# Altium project SuperKnobLite.PrjPcb
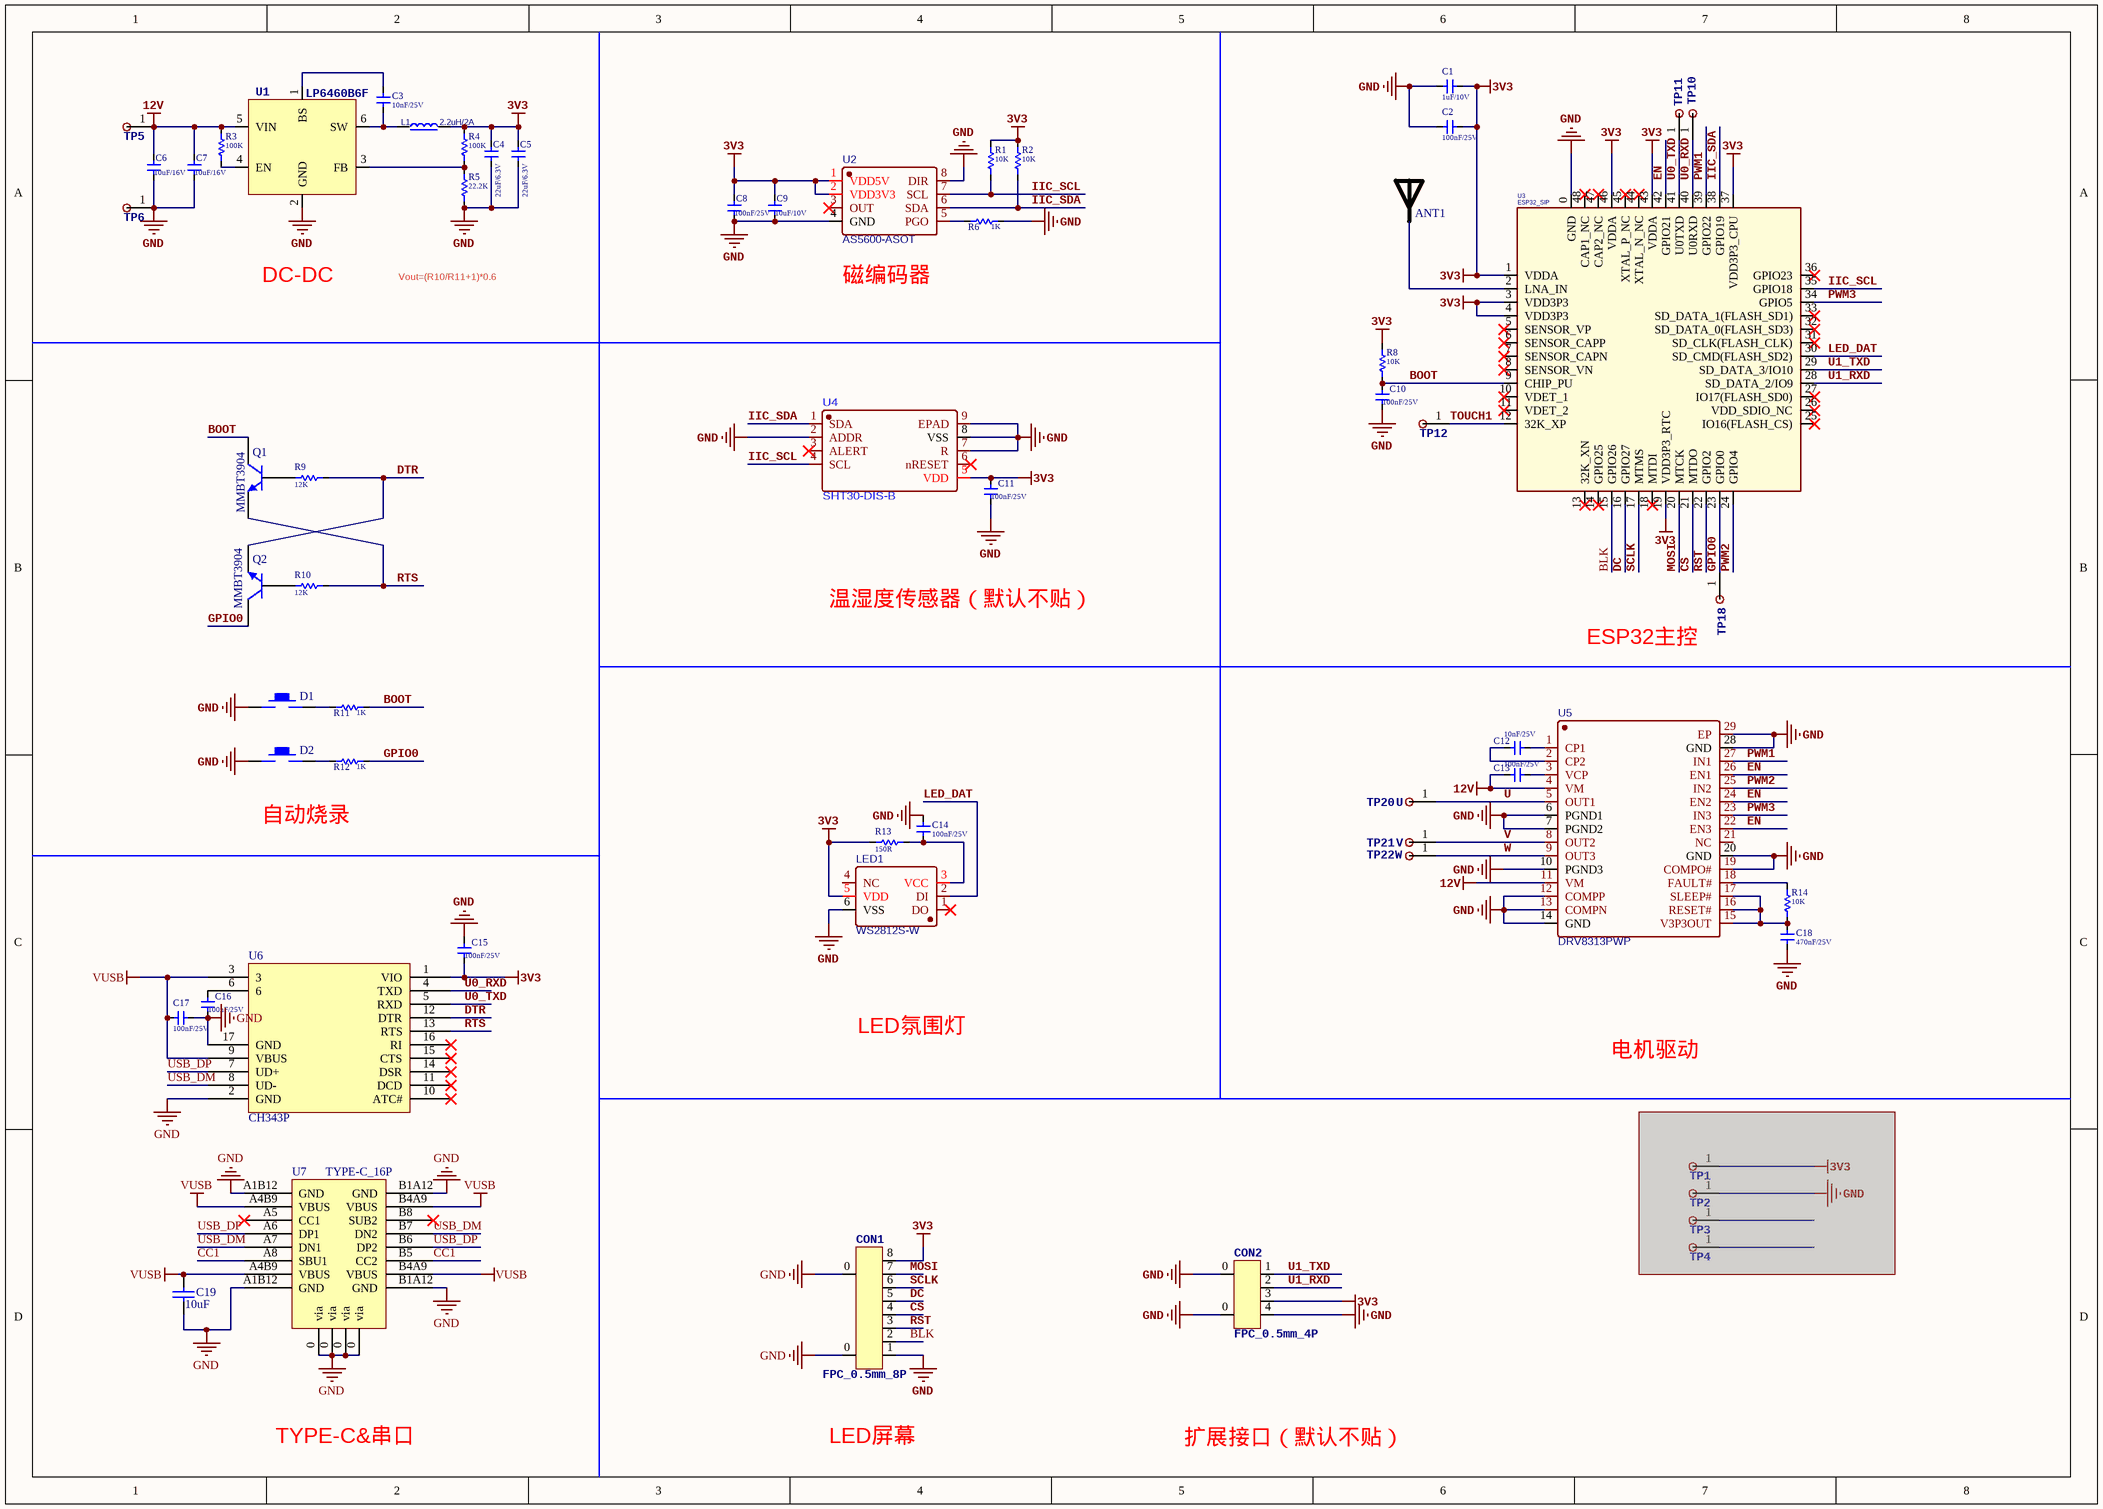
[diagram p0: SuperKnobLite.SchDoc]
1 sheet, 61 parts. Net scope: global (net labels, ports and power ports of the same name join across sheets).
Board file: SuperKnobLite.PcbDoc

## Sheet SuperKnobLite.SchDoc
size A3

### Parts
ANT1  RAINSUN  [ANT-Rainsun-AN5120]  (value not drawn)
C1  1uF/10V  [CAPC_0402]
C2  100nF/25V  [CAPC_0402]
C3  10nF/25V  [CAPC_0402]
C4  22uF/6.3V  [CAPC_0805]
C5  22uF/6.3V  [CAPC_0805]
C6  10uF/16V  [CAPC_0805]
C7  10uF/16V  [CAPC_0805]
C8  100nF/25V  [CAPC_0402]
C9  10uF/10V  [CAPC_0402]
C10  100nF/25V  [CAPC_0402]
C11  100nF/25V  [CAPC_0402]
C12  10nF/25V  [CAPC_0402]
C13  100nF/25V  [CAPC_0402]
C14  100nF/25V  [CAPC_0402]
C15  100nF/25V  [CAPC_0402]
C16  100nF/25V  [CAPC_0402]
C17  100nF/25V  [CAPC_0402]
C18  470nF/25V  [CAPC_0402]
C19  10uF  [CAPC_0603]
CON1  FPC_0.5mm_8P  [FFC_0.5_8]
CON2  FPC_0.5mm_4P  [FPC_0.5_4P]
D1  KEY_M  [KEY]  (value not drawn)
D2  KEY_M  [KEY]  (value not drawn)
L1  2.2uH/2A  [Inductor_CD_43]
LED1  WS2812S-W  [LED-SMD_6P-L5.0-W5.0-TL]
Q1  MMBT3904  [SOT23_3]
Q2  MMBT3904  [SOT23_3]
R1  10K  [RESC_0402]
R2  10K  [RESC_0402]
R3  100K  [RESC_0402]
R4  100K  [RESC_0402]
R5  22.2K  [RESC_0402]
R6  1K  [RESC_0402]
R8  10K  [RESC_0402]
R9  12K  [RESC_0402]
R10  12K  [RESC_0402]
R11  1K  [RESC_0402]
R12  1K  [RESC_0402]
R13  150R  [RESC_0603]
R14  10K  [RESC_0402]
TP1  TP  [TP_1.6x2.2mm]  (value not drawn)  (masked out: inside a compile mask, not in the netlist)
TP2  TP  [TP_1.6x2.2mm]  (value not drawn)  (masked out: inside a compile mask, not in the netlist)
TP3  TP  [TP_1.6x2.2mm]  (value not drawn)  (masked out: inside a compile mask, not in the netlist)
TP4  TP  [TP_1.6x2.2mm]  (value not drawn)  (masked out: inside a compile mask, not in the netlist)
TP5  TP  [TP_1.6x2.2mm]  (value not drawn)
TP6  TP  [TP_1.6x2.2mm]  (value not drawn)
TP10  TP  [TP]  (value not drawn)
TP11  TP  [TP]  (value not drawn)
TP12  TP  [TP - 1mm]  (value not drawn)
TP18  TP  [TP]  (value not drawn)
TP20  U  [TP_1.6x2.2mm]
TP21  V  [TP_1.6x2.2mm]
TP22  W  [TP_1.6x2.2mm]
U1  LP6460B6F  [SOT23_6]
U2  AS5600-ASOT  [SOIC_8]
U3  ESP32_SIP  [QFN-48_7X7]
U4  SHT30-DIS-B  [DFN_8]
U5  DRV8313PWP  [TSSOP_28]
U6  CH343P  [QFN16_3X3]
U7  TYPE-C_16P  [Type_c_16p]

### Nets
3V3: C1.2 C2.2 C4.2 C5.2 C8.2 C9.2 C11.2 C15.1 CON1.8 CON2.3 L1.1 LED1.5(VDD) R1.2 R2.2 R4.1 R8.1 R13.1 U2.1(VDD5V) U2.2(VDD3V3) U3.1(VDDA) U3.3(VDD3P3) U3.4(VDD3P3) U3.19(VDD3P3_RTC) U3.37(VDD3P3_CPU) U3.43(VDDA) U3.46(VDDA) U4.5(VDD) U6.1(VIO)
12V: C6.2 C7.2 C13.1 R3.1 TP5.1 U1.5(VIN) U5.4(VM) U5.11(VM)
GND: C1.1 C2.1 C4.1 C5.1 C6.1 C7.1 C8.1 C9.1 C10.1 C11.1 C14.2 C15.2 C16.1 C17.1 C18.1 C19.1 CON1.0 CON1.1 CON2.0 CON2.4 D1.1 D2.1 LED1.6(VSS) R5.2 R6.2 TP6.1 U1.2(GND) U2.4(GND) U2.8(DIR) U3.0(GND) U4.2(ADDR) U4.7(R) U4.8(VSS) U4.9(EPAD) U5.6(PGND1) U5.7(PGND2) U5.10(PGND3) U5.12(COMPP) U5.13(COMPN) U5.14(GND) U5.19(COMPO#) U5.20(GND) U5.28(GND) U5.29(EP) U6.2(GND) U6.17(GND) U7.0(via) U7.A1B12(GND) U7.B1A12(GND)
VUSB: C17.2 C19.2 U6.3 U6.9(VBUS) U7.A4B9(VBUS) U7.B4A9(VBUS)
BLK: CON1.2 U3.15(GPIO26)
BOOT: C10.2 Q1.3(C) R8.2 R11.2 U3.9(CHIP_PU)
CC1: U7.A8(SBU1) U7.B5(CC2)
CS: CON1.4 U3.21(MTDO)
DC: CON1.5 U3.16(GPIO27)
DTR: Q2.2(E) R9.2 U6.12(DTR)
EN: U3.42(GPIO21) U5.22(EN3) U5.24(EN2) U5.26(EN1)
GPIO0: Q2.3(C) R12.2 TP18.1 U3.23(GPIO0)
IIC_SCL: R1.1 U2.7(SCL) U3.35(GPIO18) U4.4(SCL)
IIC_SDA: R2.1 U2.6(SDA) U3.38(GPIO19) U4.1(SDA)
LED_DAT: LED1.2(DI) U3.30(SD_CMD(FLASH_SD2))
MOSI: CON1.7 U3.20(MTCK)
PWM1: U3.39(GPIO22) U5.27(IN1)
PWM2: U3.24(GPIO4) U5.25(IN2)
PWM3: U3.34(GPIO5) U5.23(IN3)
RST: CON1.3 U3.22(GPIO2)
RTS: Q1.2(E) R10.2 U6.13(RTS)
SCLK: CON1.6 U3.17(MTMS)
TOUCH1: TP12.1 U3.12(32K_XP)
U: TP20.1 U5.5(OUT1)
U0_RXD: TP10.1 U3.40(U0RXD) U6.4(TXD)
U0_TXD: TP11.1 U3.41(U0TXD) U6.5(RXD)
U1_RXD: CON2.2 U3.28(SD_DATA_2/IO9)
U1_TXD: CON2.1 U3.29(SD_DATA_3/IO10)
USB_DM: U6.8(UD-) U7.A7(DN1) U7.B7(DN2)
USB_DP: U6.7(UD+) U7.A6(DP1) U7.B6(DP2)
V: TP21.1 U5.8(OUT2)
W: TP22.1 U5.9(OUT3)
NetANT1_1: ANT1.1 U3.2(LNA_IN)
NetC3_1: C3.1 L1.2 U1.6(SW)
NetC3_2: C3.2 U1.1(BS)
NetC12_1: C12.1 U5.2(CP2)
NetC12_2: C12.2 U5.1(CP1)
NetC13_2: C13.2 U5.3(VCP)
NetC14_1: C14.1 LED1.3(VCC) R13.2
NetC16_2: C16.2 U6.6
NetC18_2: C18.2 R14.2 U5.15(V3P3OUT) U5.16(RESET#) U5.17(SLEEP#)
NetD1_2: D1.2 R11.1
NetD2_2: D2.2 R12.1
NetQ1_1: Q1.1(B) R9.1
NetQ2_1: Q2.1(B) R10.1
NetR3_2: R3.2 U1.4(EN)
NetR4_2: R4.2 R5.1 U1.3(FB)
NetR6_1: R6.1 U2.5(PGO)
NetR14_1: R14.1 U5.18(FAULT#)

Not connected (* = marked no-connect by the designer): LED1 1(DO)* 4(NC); U2 3(OUT)*; U3 5(SENSOR_VP)* 6(SENSOR_CAPP)* 7(SENSOR_CAPN)* 8(SENSOR_VN)* 10(VDET_1)* 11(VDET_2)* 13(32K_XN)* 14(GPIO25)* 18(MTDI)* 25(IO16(FLASH_CS))* 26(VDD_SDIO_NC)* 27(IO17(FLASH_SD0))* 31(SD_CLK(FLASH_CLK))* 32(SD_DATA_0(FLASH_SD3))* 33(SD_DATA_1(FLASH_SD1))* 36(GPIO23)* 44(XTAL_N_NC)* 45(XTAL_P_NC)* 47(CAP2_NC)* 48(CAP1_NC)*; U4 3(ALERT)* 6(nRESET)*; U5 21(NC); U6 10(ATC#)* 11(DCD)* 14(DSR)* 15(CTS)* 16(RI)*; U7 A5(CC1)* B8(SUB2)*

### Notes on the sheet
- DC-DC
- Vout=(R10/R11+1)*0.6
- (near U2) 磁编码器
- 温湿度传感器（默认不贴）
- ESP32主控
- 自动烧录
- LED氛围灯
- 电机驱动
- TYPE-C&串口
- LED屏幕
- 扩展接口（默认不贴）

### Library data of the parts
ANT1 = ANT-Rainsun-AP5120: 贴片天线
C1-C18 = 电容-0402: 贴片电容; Value: 0.1u
C19 = Cap
CON1 = FPC_0.5mm_8P: FPC连接器
CON2 = FPC_0.5mm_4P: FPC连接器
D1 D2 = KEY: 按键
L1 = PL4020: 贴片电感; Material name: 功率电感; Value: WPN4020H2R2MT; PCB DECAL: PL4020
LED1 = WS2812S-W: BOM_Manufacturer: Worldsemi; Contributor: LCSC; BOM_Supplier: LCSC; BOM_Manufacturer Part: WS2812S-W; BOM_Supplier Part: C114584; BOM_JLCPCB Part Class: Extended Part; spicePre: L; spiceSymbolName: WS2812S-W
Q1 Q2 = SMT_TRIODE_NPN: Surface mount NPN transistor, package SOT-23
R1-R6 R8-R14 = 电阻-0402: 贴片电阻; Value: 22R
TP1-TP6 TP10-TP12 TP18 TP20-TP22 = TP: 测试点
U1 = LP6460B6F: DC-DC芯片
U2 = AS5600-ASOT: 磁编码器; BOM_Manufacturer: Advanced Monolithic Systems; Contributor: LCSC; BOM_Supplier: LCSC; BOM_Supplier Part: C499458; BOM_Manufacturer Part: AS5600-ASOT; BOM_JLCPCB Part Class: Extended Part; spicePre: U; spiceSymbolName: AS5600-ASOT
U3 = ESP32-PICO: 主控芯片
U4 = SHT30-DIS-B: Sensor
U5 = DRV8313PWP: 驱动芯片; BOM_Manufacturer: TI(德州仪器); Contributor: LCSC; BOM_Supplier: LCSC; BOM_Supplier Part: C2863441; BOM_Manufacturer Part: DRV8313PWP; spicePre: U; spiceSymbolName: DRV8313PWP
U6 = CH343P: USB转TTL; PART DESC: SINGLE-CHIP USB TO UART BRIDGE, QFN28, RoHS.; PART NUMBER: CP2102; MFG #1: SILICON LABS; Value: Value; RefDes: RefDes; Type: DEV
U7 = TYPE-C_16P: Type-c